# Altium schematic sheet CM5 Adapter.SchDoc
size C; SheetNumber: 1; SheetTotal: 1
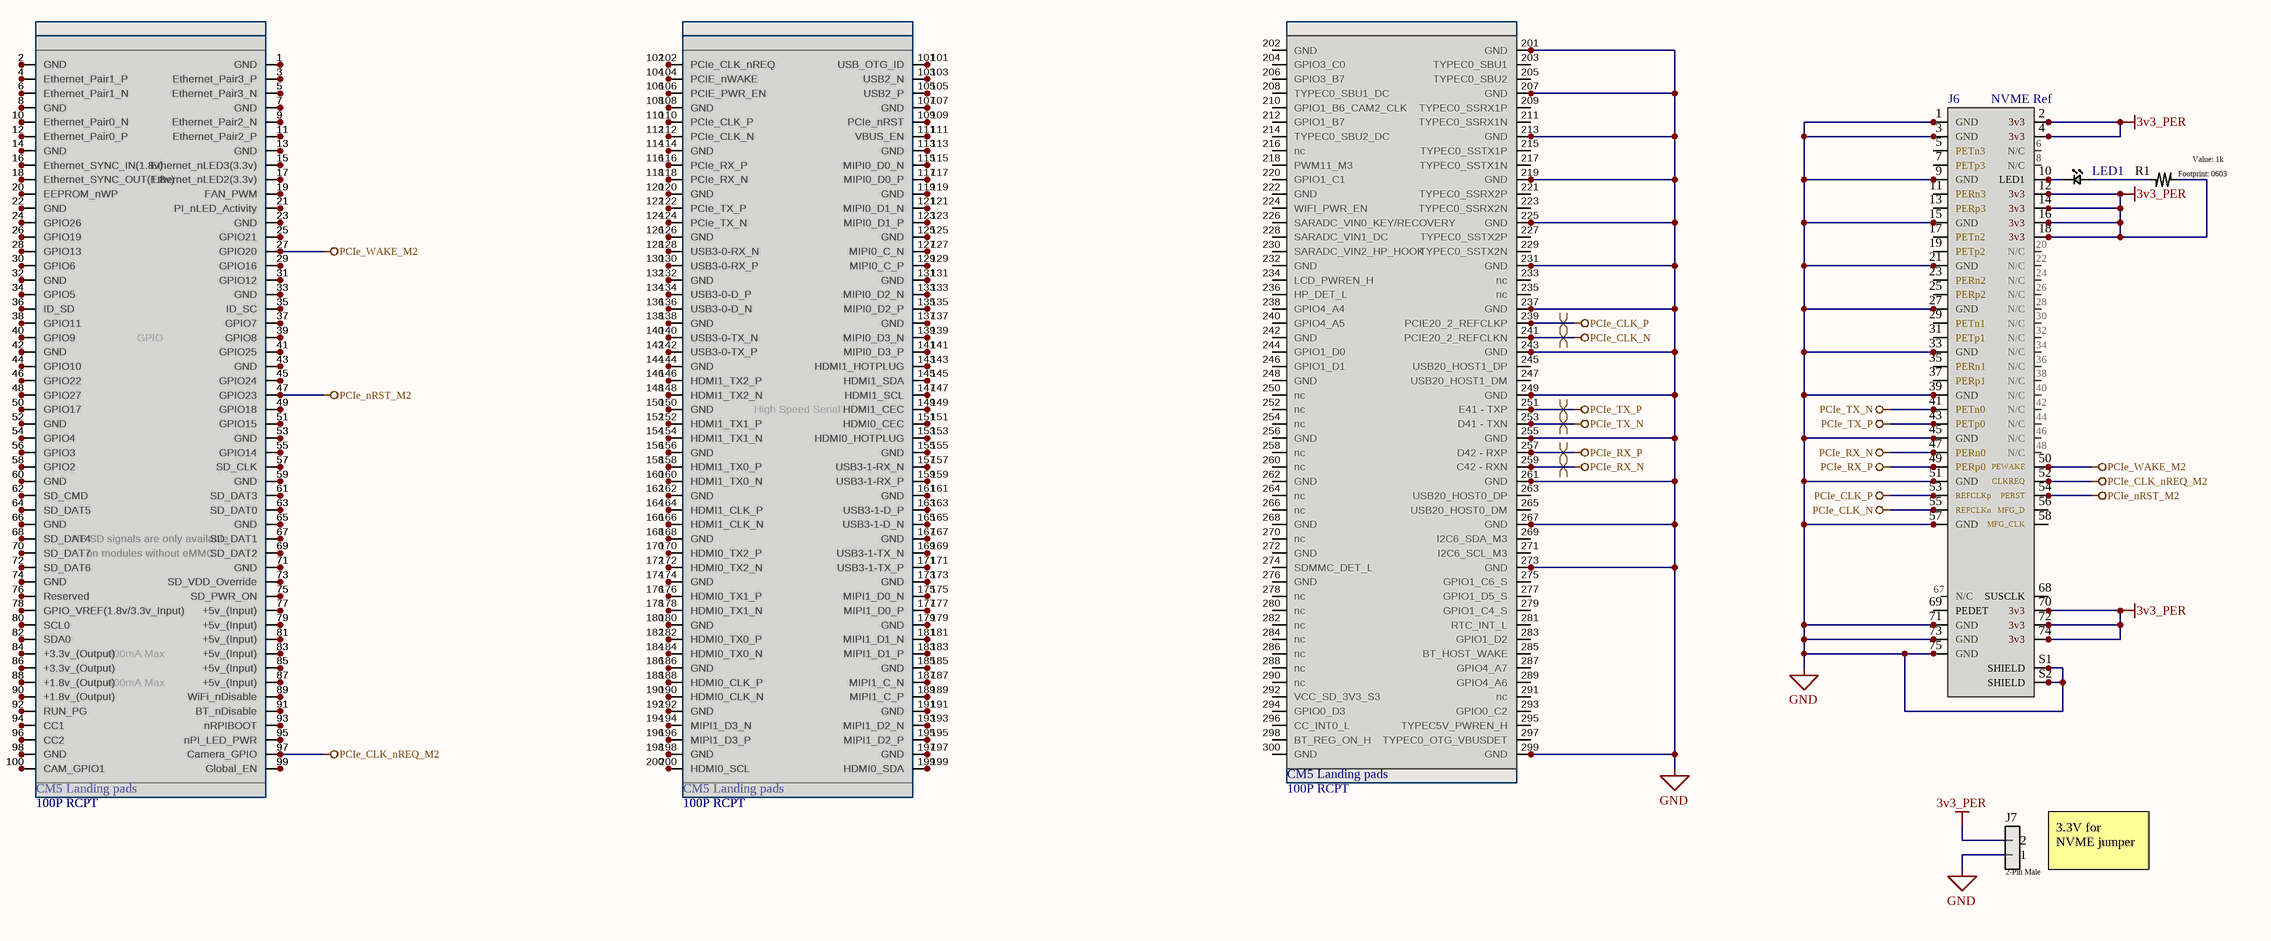
[diagram p0: CM5 Adapter.SchDoc]

## Parts
J1  100P RCPT  [DF40C-100DP-0.4V(51)]
J2  100P RCPT  [DF40C-100DP-0.4V(51)]
J3  100P RCPT  [DF40HC(3.0)-100DS-0.4V(51)]
J4  100P RCPT  [DF40HC(3.0)-100DS-0.4V(51)]
J5  100P RCPT  [DF40HC(3.0)-100DS-0.4V(51)]
J6  M.2 M KEY  [1-2199230-6]  (value not drawn)
J7  2-Pin Male  [0022057025]
LED1  LTST-C191KGKT  [0603 (1608 Metric) Concave]  (value not drawn)
M.1  NVME Ref  [NVME-Ref]
R1  value 1k  [0603]  (hidden comment: Generic Resistor)
rPI1  CM5 Landing pads  [rP-200P-CM-REP]  (parts A,B of 2)
rxPI1  CM5 Landing pads  [RX-300P-CM-FTPD]  (parts A,B,C of 3)

## Nets
3v3_PER: J6.2(3v3) J6.4(3v3) J6.12(3v3) J6.14(3v3) J6.16(3v3) J6.18(3v3) J6.70(3v3) J6.72(3v3) J6.74(3v3) J7.2 M.1.2(3v3) M.1.4(3v3) M.1.12(3v3) M.1.14(3v3) M.1.16(3v3) M.1.18(3v3) M.1.70(3v3) M.1.72(3v3) M.1.74(3v3) R1.2
GND: J3.2 J3.8 J3.14 J3.20 J3.26 J3.32 J3.38 J3.44 J3.50 J3.56 J3.62 J3.68 J3.74 J3.100 J6.1(GND) J6.3(GND) J6.9(GND) J6.15(GND) J6.21(GND) J6.27(GND) J6.33(GND) J6.39(GND) J6.45(GND) J6.51(GND) J6.57(GND) J6.71(GND) J6.73(GND) J6.75(GND) J6.S1(SHIELD) J6.S2(SHIELD) J7.1 M.1.1(GND) M.1.3(GND) M.1.9(GND) M.1.15(GND) M.1.21(GND) M.1.27(GND) M.1.33(GND) M.1.39(GND) M.1.45(GND) M.1.51(GND) M.1.57(GND) M.1.71(GND) M.1.73(GND) M.1.75(GND) M.1.S1(SHIELD) M.1.S2(SHIELD) M.1.SHD(SHIELD) rxPI1.201(GND) rxPI1.207(GND) rxPI1.213(GND) rxPI1.219(GND) rxPI1.225(GND) rxPI1.231(GND) rxPI1.237(GND) rxPI1.243(GND) rxPI1.249(GND) rxPI1.255(GND) rxPI1.261(GND) rxPI1.267(GND) rxPI1.273(GND) rxPI1.299(GND)
PCIe_CLK_N: J3.42 J6.55(REFCLKn) M.1.55(REFCLKn) rxPI1.241(PCIE20_2_REFCLKN)
PCIe_CLK_nREQ_M2: J1.98 J4.97 J6.52(CLKREQ) M.1.52(CLKREQ) rPI1.97(Camera_GPIO) rxPI1.97(Camera_GPIO)
PCIe_CLK_P: J3.40 J6.53(REFCLKp) M.1.53(REFCLKp) rxPI1.239(PCIE20_2_REFCLKP)
PCIe_nRST_M2: J1.48 J4.47 J6.54(PERST) M.1.54(PERST) rPI1.47(GPIO23) rxPI1.47(GPIO23)
PCIe_RX_N: J3.60 J6.47(PERn0) M.1.47(PERn0) rxPI1.259(C42_-_RXN)
PCIe_RX_P: J3.58 J6.49(PERp0) M.1.49(PERp0) rxPI1.257(D42_-_RXP)
PCIe_TX_N: J3.54 J6.41(PETn0) M.1.41(PETn0) rxPI1.253(D41_-_TXN)
PCIe_TX_P: J3.52 J6.43(PETp0) M.1.43(PETp0) rxPI1.251(E41_-_TXP)
PCIe_WAKE_M2: J1.28 J4.27 J6.50(PEWAKE) M.1.50(PEWAKE) rPI1.27(GPIO20) rxPI1.27(GPIO20)
NetJ1_1: J1.1 J4.2 rPI1.2(GND) rxPI1.2(GND)
NetJ1_2: J1.2 J4.1 rPI1.1(GND) rxPI1.1(GND)
NetJ1_3: J1.3 J4.4 rPI1.4(Ethernet_Pair1_P) rxPI1.4(Ethernet_Pair1_P)
NetJ1_4: J1.4 J4.3 rPI1.3(Ethernet_Pair3_P) rxPI1.3(Ethernet_Pair3_P)
NetJ1_5: J1.5 J4.6 rPI1.6(Ethernet_Pair1_N) rxPI1.6(Ethernet_Pair1_N)
NetJ1_6: J1.6 J4.5 rPI1.5(Ethernet_Pair3_N) rxPI1.5(Ethernet_Pair3_N)
NetJ1_7: J1.7 J4.8 rPI1.8(GND) rxPI1.8(GND)
NetJ1_8: J1.8 J4.7 rPI1.7(GND) rxPI1.7(GND)
NetJ1_9: J1.9 J4.10 rPI1.10(Ethernet_Pair0_N) rxPI1.10(Ethernet_Pair0_N)
NetJ1_10: J1.10 J4.9 rPI1.9(Ethernet_Pair2_N) rxPI1.9(Ethernet_Pair2_N)
NetJ1_11: J1.11 J4.12 rPI1.12(Ethernet_Pair0_P) rxPI1.12(Ethernet_Pair0_P)
NetJ1_12: J1.12 J4.11 rPI1.11(Ethernet_Pair2_P) rxPI1.11(Ethernet_Pair2_P)
NetJ1_13: J1.13 J4.14 rPI1.14(GND) rxPI1.14(GND)
NetJ1_14: J1.14 J4.13 rPI1.13(GND) rxPI1.13(GND)
NetJ1_15: J1.15 J4.16 rPI1.16(Ethernet_SYNC_IN(1.8v)) rxPI1.16(Ethernet_SYNC_IN(1.8v))
NetJ1_16: J1.16 J4.15 rPI1.15(Ethernet_nLED3(3.3v)) rxPI1.15(Ethernet_nLED3(3.3v))
NetJ1_17: J1.17 J4.18 rPI1.18(Ethernet_SYNC_OUT(1.8v)) rxPI1.18(Ethernet_SYNC_OUT(1.8v))
NetJ1_18: J1.18 J4.17 rPI1.17(Ethernet_nLED2(3.3v)) rxPI1.17(Ethernet_nLED2(3.3v))
NetJ1_19: J1.19 J4.20 rPI1.20(EEPROM_nWP) rxPI1.20(EEPROM_nWP)
NetJ1_20: J1.20 J4.19 rPI1.19(FAN_PWM) rxPI1.19(FAN_PWM)
NetJ1_21: J1.21 J4.22 rPI1.22(GND) rxPI1.22(GND)
NetJ1_22: J1.22 J4.21 rPI1.21(PI_nLED_Activity) rxPI1.21(PI_nLED_Activity)
NetJ1_23: J1.23 J4.24 rPI1.24(GPIO26) rxPI1.24(GPIO26)
NetJ1_24: J1.24 J4.23 rPI1.23(GND) rxPI1.23(GND)
NetJ1_25: J1.25 J4.26 rPI1.26(GPIO19) rxPI1.26(GPIO19)
NetJ1_26: J1.26 J4.25 rPI1.25(GPIO21) rxPI1.25(GPIO21)
NetJ1_27: J1.27 J4.28 rPI1.28(GPIO13) rxPI1.28(GPIO13)
NetJ1_29: J1.29 J4.30 rPI1.30(GPIO6) rxPI1.30(GPIO6)
NetJ1_30: J1.30 J4.29 rPI1.29(GPIO16) rxPI1.29(GPIO16)
NetJ1_31: J1.31 J4.32 rPI1.32(GND) rxPI1.32(GND)
NetJ1_32: J1.32 J4.31 rPI1.31(GPIO12) rxPI1.31(GPIO12)
NetJ1_33: J1.33 J4.34 rPI1.34(GPIO5) rxPI1.34(GPIO5)
NetJ1_34: J1.34 J4.33 rPI1.33(GND) rxPI1.33(GND)
NetJ1_35: J1.35 J4.36 rPI1.36(ID_SD) rxPI1.36(ID_SD)
NetJ1_36: J1.36 J4.35 rPI1.35(ID_SC) rxPI1.35(ID_SC)
NetJ1_37: J1.37 J4.38 rPI1.38(GPIO11) rxPI1.38(GPIO11)
NetJ1_38: J1.38 J4.37 rPI1.37(GPIO7) rxPI1.37(GPIO7)
NetJ1_39: J1.39 J4.40 rPI1.40(GPIO9) rxPI1.40(GPIO9)
NetJ1_40: J1.40 J4.39 rPI1.39(GPIO8) rxPI1.39(GPIO8)
NetJ1_41: J1.41 J4.42 rPI1.42(GND) rxPI1.42(GND)
NetJ1_42: J1.42 J4.41 rPI1.41(GPIO25) rxPI1.41(GPIO25)
NetJ1_43: J1.43 J4.44 rPI1.44(GPIO10) rxPI1.44(GPIO10)
NetJ1_44: J1.44 J4.43 rPI1.43(GND) rxPI1.43(GND)
NetJ1_45: J1.45 J4.46 rPI1.46(GPIO22) rxPI1.46(GPIO22)
NetJ1_46: J1.46 J4.45 rPI1.45(GPIO24) rxPI1.45(GPIO24)
NetJ1_47: J1.47 J4.48 rPI1.48(GPIO27) rxPI1.48(GPIO27)
NetJ1_49: J1.49 J4.50 rPI1.50(GPIO17) rxPI1.50(GPIO17)
NetJ1_50: J1.50 J4.49 rPI1.49(GPIO18) rxPI1.49(GPIO18)
NetJ1_51: J1.51 J4.52 rPI1.52(GND) rxPI1.52(GND)
NetJ1_52: J1.52 J4.51 rPI1.51(GPIO15) rxPI1.51(GPIO15)
NetJ1_53: J1.53 J4.54 rPI1.54(GPIO4) rxPI1.54(GPIO4)
NetJ1_54: J1.54 J4.53 rPI1.53(GND) rxPI1.53(GND)
NetJ1_55: J1.55 J4.56 rPI1.56(GPIO3) rxPI1.56(GPIO3)
NetJ1_56: J1.56 J4.55 rPI1.55(GPIO14) rxPI1.55(GPIO14)
NetJ1_57: J1.57 J4.58 rPI1.58(GPIO2) rxPI1.58(GPIO2)
NetJ1_58: J1.58 J4.57 rPI1.57(SD_CLK) rxPI1.57(SD_CLK)
NetJ1_59: J1.59 J4.60 rPI1.60(GND) rxPI1.60(GND)
NetJ1_60: J1.60 J4.59 rPI1.59(GND) rxPI1.59(GND)
NetJ1_61: J1.61 J4.62 rPI1.62(SD_CMD) rxPI1.62(SD_CMD)
NetJ1_62: J1.62 J4.61 rPI1.61(SD_DAT3) rxPI1.61(SD_DAT3)
NetJ1_63: J1.63 J4.64 rPI1.64(SD_DAT5) rxPI1.64(SD_DAT5)
NetJ1_64: J1.64 J4.63 rPI1.63(SD_DAT0) rxPI1.63(SD_DAT0)
NetJ1_65: J1.65 J4.66 rPI1.66(GND) rxPI1.66(GND)
NetJ1_66: J1.66 J4.65 rPI1.65(GND) rxPI1.65(GND)
NetJ1_67: J1.67 J4.68 rPI1.68(SD_DAT4) rxPI1.68(SD_DAT4)
NetJ1_68: J1.68 J4.67 rPI1.67(SD_DAT1) rxPI1.67(SD_DAT1)
NetJ1_69: J1.69 J4.70 rPI1.70(SD_DAT7) rxPI1.70(SD_DAT7)
NetJ1_70: J1.70 J4.69 rPI1.69(SD_DAT2) rxPI1.69(SD_DAT2)
NetJ1_71: J1.71 J4.72 rPI1.72(SD_DAT6) rxPI1.72(SD_DAT6)
NetJ1_72: J1.72 J4.71 rPI1.71(GND) rxPI1.71(GND)
NetJ1_73: J1.73 J4.74 rPI1.74(GND) rxPI1.74(GND)
NetJ1_74: J1.74 J4.73 rPI1.73(SD_VDD_Override) rxPI1.73(SD_VDD_Override)
NetJ1_75: J1.75 J4.76 rPI1.76(Reserved) rxPI1.76(Reserved)
NetJ1_76: J1.76 J4.75 rPI1.75(SD_PWR_ON) rxPI1.75(SD_PWR_ON)
NetJ1_77: J1.77 J4.78 rPI1.78(GPIO_VREF(1.8v/3.3v_Input)) rxPI1.78(GPIO_VREF(1.8v/3.3v_Input))
NetJ1_78: J1.78 J4.77 rPI1.77(+5v_(Input)) rxPI1.77(+5v_(Input))
NetJ1_79: J1.79 J4.80 rPI1.80(SCL0) rxPI1.80(SCL0)
NetJ1_80: J1.80 J4.79 rPI1.79(+5v_(Input)) rxPI1.79(+5v_(Input))
NetJ1_81: J1.81 J4.82 rPI1.82(SDA0) rxPI1.82(SDA0)
NetJ1_82: J1.82 J4.81 rPI1.81(+5v_(Input)) rxPI1.81(+5v_(Input))
NetJ1_83: J1.83 J4.84 rPI1.84(+3.3v_(Output)) rxPI1.84(+3.3v_(Output))
NetJ1_84: J1.84 J4.83 rPI1.83(+5v_(Input)) rxPI1.83(+5v_(Input))
NetJ1_85: J1.85 J4.86 rPI1.86(+3.3v_(Output)) rxPI1.86(+3.3v_(Output))
NetJ1_86: J1.86 J4.85 rPI1.85(+5v_(Input)) rxPI1.85(+5v_(Input))
NetJ1_87: J1.87 J4.88 rPI1.88(+1.8v_(Output)) rxPI1.88(+1.8v_(Output))
NetJ1_88: J1.88 J4.87 rPI1.87(+5v_(Input)) rxPI1.87(+5v_(Input))
NetJ1_89: J1.89 J4.90 rPI1.90(+1.8v_(Output)) rxPI1.90(+1.8v_(Output))
NetJ1_90: J1.90 J4.89 rPI1.89(WiFi_nDisable) rxPI1.89(WiFi_nDisable)
NetJ1_91: J1.91 J4.92 rPI1.92(RUN_PG) rxPI1.92(RUN_PG)
NetJ1_92: J1.92 J4.91 rPI1.91(BT_nDisable) rxPI1.91(BT_nDisable)
NetJ1_93: J1.93 J4.94 rPI1.94(CC1) rxPI1.94(CC1)
NetJ1_94: J1.94 J4.93 rPI1.93(nRPIBOOT) rxPI1.93(nRPIBOOT)
NetJ1_95: J1.95 J4.96 rPI1.96(CC2) rxPI1.96(CC2)
NetJ1_96: J1.96 J4.95 rPI1.95(nPI_LED_PWR) rxPI1.95(nPI_LED_PWR)
NetJ1_97: J1.97 J4.98 rPI1.98(GND) rxPI1.98(GND)
NetJ1_99: J1.99 J4.100 rPI1.100(CAM_GPIO1) rxPI1.100(CAM_GPIO1)
NetJ1_100: J1.100 J4.99 rPI1.99(Global_EN) rxPI1.99(Global_EN)
NetJ2_1: J2.1 J5.2 rPI1.102(PCIe_CLK_nREQ) rxPI1.102(PCIe_CLK_nREQ)
NetJ2_2: J2.2 J5.1 rPI1.101(USB_OTG_ID) rxPI1.101(USB_OTG_ID)
NetJ2_3: J2.3 J5.4 rPI1.104(PCIE_nWAKE) rxPI1.104(PCIE_nWAKE)
NetJ2_4: J2.4 J5.3 rPI1.103(USB2_N) rxPI1.103(USB2_N)
NetJ2_5: J2.5 J5.6 rPI1.106(PCIE_PWR_EN) rxPI1.106(PCIE_PWR_EN)
NetJ2_6: J2.6 J5.5 rPI1.105(USB2_P) rxPI1.105(USB2_P)
NetJ2_7: J2.7 J5.8 rPI1.108(GND) rxPI1.108(GND)
NetJ2_8: J2.8 J5.7 rPI1.107(GND) rxPI1.107(GND)
NetJ2_9: J2.9 J5.10 rPI1.110(PCIe_CLK_P) rxPI1.110(PCIe_CLK_P)
NetJ2_10: J2.10 J5.9 rPI1.109(PCIe_nRST) rxPI1.109(PCIe_nRST)
NetJ2_11: J2.11 J5.12 rPI1.112(PCIe_CLK_N) rxPI1.112(PCIe_CLK_N)
NetJ2_12: J2.12 J5.11 rPI1.111(VBUS_EN) rxPI1.111(VBUS_EN)
NetJ2_13: J2.13 J5.14 rPI1.114(GND) rxPI1.114(GND)
NetJ2_14: J2.14 J5.13 rPI1.113(GND) rxPI1.113(GND)
NetJ2_15: J2.15 J5.16 rPI1.116(PCIe_RX_P) rxPI1.116(PCIe_RX_P)
NetJ2_16: J2.16 J5.15 rPI1.115(MIPI0_D0_N) rxPI1.115(MIPI0_D0_N)
NetJ2_17: J2.17 J5.18 rPI1.118(PCIe_RX_N) rxPI1.118(PCIe_RX_N)
NetJ2_18: J2.18 J5.17 rPI1.117(MIPI0_D0_P) rxPI1.117(MIPI0_D0_P)
NetJ2_19: J2.19 J5.20 rPI1.120(GND) rxPI1.120(GND)
NetJ2_20: J2.20 J5.19 rPI1.119(GND) rxPI1.119(GND)
NetJ2_21: J2.21 J5.22 rPI1.122(PCIe_TX_P) rxPI1.122(PCIe_TX_P)
NetJ2_22: J2.22 J5.21 rPI1.121(MIPI0_D1_N) rxPI1.121(MIPI0_D1_N)
NetJ2_23: J2.23 J5.24 rPI1.124(PCIe_TX_N) rxPI1.124(PCIe_TX_N)
NetJ2_24: J2.24 J5.23 rPI1.123(MIPI0_D1_P) rxPI1.123(MIPI0_D1_P)
NetJ2_25: J2.25 J5.26 rPI1.126(GND) rxPI1.126(GND)
NetJ2_26: J2.26 J5.25 rPI1.125(GND) rxPI1.125(GND)
NetJ2_27: J2.27 J5.28 rPI1.128(USB3-0-RX_N) rxPI1.128(USB3-0-RX_N)
NetJ2_28: J2.28 J5.27 rPI1.127(MIPI0_C_N) rxPI1.127(MIPI0_C_N)
NetJ2_29: J2.29 J5.30 rPI1.130(USB3-0-RX_P) rxPI1.130(USB3-0-RX_P)
NetJ2_30: J2.30 J5.29 rPI1.129(MIPI0_C_P) rxPI1.129(MIPI0_C_P)
NetJ2_31: J2.31 J5.32 rPI1.132(GND) rxPI1.132(GND)
NetJ2_32: J2.32 J5.31 rPI1.131(GND) rxPI1.131(GND)
NetJ2_33: J2.33 J5.34 rPI1.134(USB3-0-D_P) rxPI1.134(USB3-0-D_P)
NetJ2_34: J2.34 J5.33 rPI1.133(MIPI0_D2_N) rxPI1.133(MIPI0_D2_N)
NetJ2_35: J2.35 J5.36 rPI1.136(USB3-0-D_N) rxPI1.136(USB3-0-D_N)
NetJ2_36: J2.36 J5.35 rPI1.135(MIPI0_D2_P) rxPI1.135(MIPI0_D2_P)
NetJ2_37: J2.37 J5.38 rPI1.138(GND) rxPI1.138(GND)
NetJ2_38: J2.38 J5.37 rPI1.137(GND) rxPI1.137(GND)
NetJ2_39: J2.39 J5.40 rPI1.140(USB3-0-TX_N) rxPI1.140(USB3-0-TX_N)
NetJ2_40: J2.40 J5.39 rPI1.139(MIPI0_D3_N) rxPI1.139(MIPI0_D3_N)
NetJ2_41: J2.41 J5.42 rPI1.142(USB3-0-TX_P) rxPI1.142(USB3-0-TX_P)
NetJ2_42: J2.42 J5.41 rPI1.141(MIPI0_D3_P) rxPI1.141(MIPI0_D3_P)
NetJ2_43: J2.43 J5.44 rPI1.144(GND) rxPI1.144(GND)
NetJ2_44: J2.44 J5.43 rPI1.143(HDMI1_HOTPLUG) rxPI1.143(HDMI1_HOTPLUG)
NetJ2_45: J2.45 J5.46 rPI1.146(HDMI1_TX2_P) rxPI1.146(HDMI1_TX2_P)
NetJ2_46: J2.46 J5.45 rPI1.145(HDMI1_SDA) rxPI1.145(HDMI1_SDA)
NetJ2_47: J2.47 J5.48 rPI1.148(HDMI1_TX2_N) rxPI1.148(HDMI1_TX2_N)
NetJ2_48: J2.48 J5.47 rPI1.147(HDMI1_SCL) rxPI1.147(HDMI1_SCL)
NetJ2_49: J2.49 J5.50 rPI1.150(GND) rxPI1.150(GND)
NetJ2_50: J2.50 J5.49 rPI1.149(HDMI1_CEC) rxPI1.149(HDMI1_CEC)
NetJ2_51: J2.51 J5.52 rPI1.152(HDMI1_TX1_P) rxPI1.152(HDMI1_TX1_P)
NetJ2_52: J2.52 J5.51 rPI1.151(HDMI0_CEC) rxPI1.151(HDMI0_CEC)
NetJ2_53: J2.53 J5.54 rPI1.154(HDMI1_TX1_N) rxPI1.154(HDMI1_TX1_N)
NetJ2_54: J2.54 J5.53 rPI1.153(HDMI0_HOTPLUG) rxPI1.153(HDMI0_HOTPLUG)
NetJ2_55: J2.55 J5.56 rPI1.156(GND) rxPI1.156(GND)
NetJ2_56: J2.56 J5.55 rPI1.155(GND) rxPI1.155(GND)
NetJ2_57: J2.57 J5.58 rPI1.158(HDMI1_TX0_P) rxPI1.158(HDMI1_TX0_P)
NetJ2_58: J2.58 J5.57 rPI1.157(USB3-1-RX_N) rxPI1.157(USB3-1-RX_N)
NetJ2_59: J2.59 J5.60 rPI1.160(HDMI1_TX0_N) rxPI1.160(HDMI1_TX0_N)
NetJ2_60: J2.60 J5.59 rPI1.159(USB3-1-RX_P) rxPI1.159(USB3-1-RX_P)
NetJ2_61: J2.61 J5.62 rPI1.162(GND) rxPI1.162(GND)
NetJ2_62: J2.62 J5.61 rPI1.161(GND) rxPI1.161(GND)
NetJ2_63: J2.63 J5.64 rPI1.164(HDMI1_CLK_P) rxPI1.164(HDMI1_CLK_P)
NetJ2_64: J2.64 J5.63 rPI1.163(USB3-1-D_P) rxPI1.163(USB3-1-D_P)
NetJ2_65: J2.65 J5.66 rPI1.166(HDMI1_CLK_N) rxPI1.166(HDMI1_CLK_N)
NetJ2_66: J2.66 J5.65 rPI1.165(USB3-1-D_N) rxPI1.165(USB3-1-D_N)
NetJ2_67: J2.67 J5.68 rPI1.168(GND) rxPI1.168(GND)
NetJ2_68: J2.68 J5.67 rPI1.167(GND) rxPI1.167(GND)
NetJ2_69: J2.69 J5.70 rPI1.170(HDMI0_TX2_P) rxPI1.170(HDMI0_TX2_P)
NetJ2_70: J2.70 J5.69 rPI1.169(USB3-1-TX_N) rxPI1.169(USB3-1-TX_N)
NetJ2_71: J2.71 J5.72 rPI1.172(HDMI0_TX2_N) rxPI1.172(HDMI0_TX2_N)
NetJ2_72: J2.72 J5.71 rPI1.171(USB3-1-TX_P) rxPI1.171(USB3-1-TX_P)
NetJ2_73: J2.73 J5.74 rPI1.174(GND) rxPI1.174(GND)
NetJ2_74: J2.74 J5.73 rPI1.173(GND) rxPI1.173(GND)
NetJ2_75: J2.75 J5.76 rPI1.176(HDMI0_TX1_P) rxPI1.176(HDMI0_TX1_P)
NetJ2_76: J2.76 J5.75 rPI1.175(MIPI1_D0_N) rxPI1.175(MIPI1_D0_N)
NetJ2_77: J2.77 J5.78 rPI1.178(HDMI0_TX1_N) rxPI1.178(HDMI0_TX1_N)
NetJ2_78: J2.78 J5.77 rPI1.177(MIPI1_D0_P) rxPI1.177(MIPI1_D0_P)
NetJ2_79: J2.79 J5.80 rPI1.180(GND) rxPI1.180(GND)
NetJ2_80: J2.80 J5.79 rPI1.179(GND) rxPI1.179(GND)
NetJ2_81: J2.81 J5.82 rPI1.182(HDMI0_TX0_P) rxPI1.182(HDMI0_TX0_P)
NetJ2_82: J2.82 J5.81 rPI1.181(MIPI1_D1_N) rxPI1.181(MIPI1_D1_N)
NetJ2_83: J2.83 J5.84 rPI1.184(HDMI0_TX0_N) rxPI1.184(HDMI0_TX0_N)
NetJ2_84: J2.84 J5.83 rPI1.183(MIPI1_D1_P) rxPI1.183(MIPI1_D1_P)
NetJ2_85: J2.85 J5.86 rPI1.186(GND) rxPI1.186(GND)
NetJ2_86: J2.86 J5.85 rPI1.185(GND) rxPI1.185(GND)
NetJ2_87: J2.87 J5.88 rPI1.188(HDMI0_CLK_P) rxPI1.188(HDMI0_CLK_P)
NetJ2_88: J2.88 J5.87 rPI1.187(MIPI1_C_N) rxPI1.187(MIPI1_C_N)
NetJ2_89: J2.89 J5.90 rPI1.190(HDMI0_CLK_N) rxPI1.190(HDMI0_CLK_N)
NetJ2_90: J2.90 J5.89 rPI1.189(MIPI1_C_P) rxPI1.189(MIPI1_C_P)
NetJ2_91: J2.91 J5.92 rPI1.192(GND) rxPI1.192(GND)
NetJ2_92: J2.92 J5.91 rPI1.191(GND) rxPI1.191(GND)
NetJ2_93: J2.93 J5.94 rPI1.194(MIPI1_D3_N) rxPI1.194(MIPI1_D3_N)
NetJ2_94: J2.94 J5.93 rPI1.193(MIPI1_D2_N) rxPI1.193(MIPI1_D2_N)
NetJ2_95: J2.95 J5.96 rPI1.196(MIPI1_D3_P) rxPI1.196(MIPI1_D3_P)
NetJ2_96: J2.96 J5.95 rPI1.195(MIPI1_D2_P) rxPI1.195(MIPI1_D2_P)
NetJ2_97: J2.97 J5.98 rPI1.198(GND) rxPI1.198(GND)
NetJ2_98: J2.98 J5.97 rPI1.197(GND) rxPI1.197(GND)
NetJ2_99: J2.99 J5.100 rPI1.200(HDMI0_SCL) rxPI1.200(HDMI0_SCL)
NetJ2_100: J2.100 J5.99 rPI1.199(HDMI0_SDA) rxPI1.199(HDMI0_SDA)
NetJ3_1: J3.1 rxPI1.202(GND)
NetJ3_3: J3.3 rxPI1.204(GPIO3_C0)
NetJ3_4: J3.4 rxPI1.203(TYPEC0_SBU1)
NetJ3_5: J3.5 rxPI1.206(GPIO3_B7)
NetJ3_6: J3.6 rxPI1.205(TYPEC0_SBU2)
NetJ3_7: J3.7 rxPI1.208(TYPEC0_SBU1_DC)
NetJ3_9: J3.9 rxPI1.210(GPIO1_B6_CAM2_CLK)
NetJ3_10: J3.10 rxPI1.209(TYPEC0_SSRX1P)
NetJ3_11: J3.11 rxPI1.212(GPIO1_B7)
NetJ3_12: J3.12 rxPI1.211(TYPEC0_SSRX1N)
NetJ3_13: J3.13 rxPI1.214(TYPEC0_SBU2_DC)
NetJ3_15: J3.15 rxPI1.216(nc)
NetJ3_16: J3.16 rxPI1.215(TYPEC0_SSTX1P)
NetJ3_17: J3.17 rxPI1.218(PWM11_M3)
NetJ3_18: J3.18 rxPI1.217(TYPEC0_SSTX1N)
NetJ3_19: J3.19 rxPI1.220(GPIO1_C1)
NetJ3_21: J3.21 rxPI1.222(GND)
NetJ3_22: J3.22 rxPI1.221(TYPEC0_SSRX2P)
NetJ3_23: J3.23 rxPI1.224(WIFI_PWR_EN)
NetJ3_24: J3.24 rxPI1.223(TYPEC0_SSRX2N)
NetJ3_25: J3.25 rxPI1.226(SARADC_VIN0_KEY/RECOVERY)
NetJ3_27: J3.27 rxPI1.228(SARADC_VIN1_DC)
NetJ3_28: J3.28 rxPI1.227(TYPEC0_SSTX2P)
NetJ3_29: J3.29 rxPI1.230(SARADC_VIN2_HP_HOOK)
NetJ3_30: J3.30 rxPI1.229(TYPEC0_SSTX2N)
NetJ3_31: J3.31 rxPI1.232(GND)
NetJ3_33: J3.33 rxPI1.234(LCD_PWREN_H)
NetJ3_34: J3.34 rxPI1.233(nc)
NetJ3_35: J3.35 rxPI1.236(HP_DET_L)
NetJ3_36: J3.36 rxPI1.235(nc)
NetJ3_37: J3.37 rxPI1.238(GPIO4_A4)
NetJ3_39: J3.39 rxPI1.240(GPIO4_A5)
NetJ3_41: J3.41 rxPI1.242(GND)
NetJ3_43: J3.43 rxPI1.244(GPIO1_D0)
NetJ3_45: J3.45 rxPI1.246(GPIO1_D1)
NetJ3_46: J3.46 rxPI1.245(USB20_HOST1_DP)
NetJ3_47: J3.47 rxPI1.248(GND)
NetJ3_48: J3.48 rxPI1.247(USB20_HOST1_DM)
NetJ3_49: J3.49 rxPI1.250(nc)
NetJ3_51: J3.51 rxPI1.252(nc)
NetJ3_53: J3.53 rxPI1.254(nc)
NetJ3_55: J3.55 rxPI1.256(GND)
NetJ3_57: J3.57 rxPI1.258(nc)
NetJ3_59: J3.59 rxPI1.260(nc)
NetJ3_61: J3.61 rxPI1.262(GND)
NetJ3_63: J3.63 rxPI1.264(nc)
NetJ3_64: J3.64 rxPI1.263(USB20_HOST0_DP)
NetJ3_65: J3.65 rxPI1.266(nc)
NetJ3_66: J3.66 rxPI1.265(USB20_HOST0_DM)
NetJ3_67: J3.67 rxPI1.268(GND)
NetJ3_69: J3.69 rxPI1.270(nc)
NetJ3_70: J3.70 rxPI1.269(I2C6_SDA_M3)
NetJ3_71: J3.71 rxPI1.272(GND)
NetJ3_72: J3.72 rxPI1.271(I2C6_SCL_M3)
NetJ3_73: J3.73 rxPI1.274(SDMMC_DET_L)
NetJ3_75: J3.75 rxPI1.276(GND)
NetJ3_76: J3.76 rxPI1.275(GPIO1_C6_S)
NetJ3_77: J3.77 rxPI1.278(nc)
NetJ3_78: J3.78 rxPI1.277(GPIO1_D5_S)
NetJ3_79: J3.79 rxPI1.280(nc)
NetJ3_80: J3.80 rxPI1.279(GPIO1_C4_S)
NetJ3_81: J3.81 rxPI1.282(nc)
NetJ3_82: J3.82 rxPI1.281(RTC_INT_L)
NetJ3_83: J3.83 rxPI1.284(nc)
NetJ3_84: J3.84 rxPI1.283(GPIO1_D2)
NetJ3_85: J3.85 rxPI1.286(nc)
NetJ3_86: J3.86 rxPI1.285(BT_HOST_WAKE)
NetJ3_87: J3.87 rxPI1.288(nc)
NetJ3_88: J3.88 rxPI1.287(GPIO4_A7)
NetJ3_89: J3.89 rxPI1.290(nc)
NetJ3_90: J3.90 rxPI1.289(GPIO4_A6)
NetJ3_91: J3.91 rxPI1.292(VCC_SD_3V3_S3)
NetJ3_92: J3.92 rxPI1.291(nc)
NetJ3_93: J3.93 rxPI1.294(GPIO0_D3)
NetJ3_94: J3.94 rxPI1.293(GPIO0_C2)
NetJ3_95: J3.95 rxPI1.296(CC_INT0_L)
NetJ3_96: J3.96 rxPI1.295(TYPEC5V_PWREN_H)
NetJ3_97: J3.97 rxPI1.298(BT_REG_ON_H)
NetJ3_98: J3.98 rxPI1.297(TYPEC0_OTG_VBUSDET)
NetJ3_99: J3.99 rxPI1.300(GND)
NetJ6_5: J6.5(PETn3) M.1.5(PETn3)
NetJ6_6: J6.6(N/C) M.1.6(N/C)
NetJ6_7: J6.7(PETp3) M.1.7(PETp3)
NetJ6_8: J6.8(N/C) M.1.8(N/C)
NetJ6_10: J6.10(LED1) LED1.1(Cathode) M.1.10(LED1)
NetJ6_11: J6.11(PERn3) M.1.11(PERn3)
NetJ6_13: J6.13(PERp3) M.1.13(PERp3)
NetJ6_17: J6.17(PETn2) M.1.17(PETn2)
NetJ6_19: J6.19(PETp2) M.1.19(PETp2)
NetJ6_20: J6.20(N/C) M.1.20(N/C)
NetJ6_22: J6.22(N/C) M.1.22(N/C)
NetJ6_23: J6.23(PERn2) M.1.23(PERn2)
NetJ6_24: J6.24(N/C) M.1.24(N/C)
NetJ6_25: J6.25(PERp2) M.1.25(PERp2)
NetJ6_26: J6.26(N/C) M.1.26(N/C)
NetJ6_28: J6.28(N/C) M.1.28(N/C)
NetJ6_29: J6.29(PETn1) M.1.29(PETn1)
NetJ6_30: J6.30(N/C) M.1.30(N/C)
NetJ6_31: J6.31(PETp1) M.1.31(PETp1)
NetJ6_32: J6.32(N/C) M.1.32(N/C)
NetJ6_34: J6.34(N/C) M.1.34(N/C)
NetJ6_35: J6.35(PERn1) M.1.35(PERn1)
NetJ6_36: J6.36(N/C) M.1.36(N/C)
NetJ6_37: J6.37(PERp1) M.1.37(PERp1)
NetJ6_38: J6.38(N/C) M.1.38(N/C)
NetJ6_40: J6.40(N/C) M.1.40(N/C)
NetJ6_42: J6.42(N/C) M.1.42(N/C)
NetJ6_44: J6.44(N/C) M.1.44(N/C)
NetJ6_46: J6.46(N/C) M.1.46(N/C)
NetJ6_48: J6.48(N/C) M.1.48(N/C)
NetJ6_56: J6.56(MFG_D) M.1.56(MFG_D)
NetJ6_58: J6.58(MFG_CLK) M.1.58(MFG_CLK)
NetJ6_67: J6.67(N/C) M.1.67(N/C)
NetJ6_68: J6.68(SUSCLK) M.1.68(SUSCLK)
NetJ6_69: J6.69(PEDET) M.1.69(PEDET)
NetLED1_2: LED1.2(Anode) R1.1

## Layout directives
differential pair: PCIe_CLK_N, PCIe_CLK_P, PCIe_RX_N, PCIe_RX_P, PCIe_TX_N, PCIe_TX_P

## Notes on the sheet
- (near J7) 3.3V for NVME jumper
- REV
- REVISIONS
- DATE
- DESCRIPTION
- BY
- UNLESS OTHERWISE SPECIFIED, DRAWING DEFINITIONS AND TOLERANCES SHALL BE FOUND UNDER SUPPLIER STANDARDS SS-001. THIS PART AND ALL COMPONENTS OF IT MUST BE RoHS & REACH COMPLIANT. A CERTIFICATE OF COMPLIANCE MUST BE PROVIDED UPON REQUEST.
- ALL INFORMATION ON THIS DOCUMENT IS THE SOLE PROPERTY OF GAMBER-JOHNSON AND SHALL NOT BE COPIED, REPRODUCED, USED OR DISCLOSED IN WHOLE OR IN PART WITHOUT THE WRITTEN CONSENT OF GAMBER-JOHNSON
- TOLERANCES
  .00 ± .060
  .000 ± .020
  .0000 ± .005
  ANGELS ± 1°
- DRAWN BY:
- PROJECT NUMBER:
- SHEET TITLE:
- SHEET
- OF
- DATE:
- LOCATION:
- ASSEMBLY NUMBER
- SIZE
- GAMBER-JOHNSON LLC
  5001 JOERNS DR.
  STEVENS POINT, WI 54481
  +1 (715) 344-5209
- B
- (in symbol RP-CM5-Rep, part A) GPIO; NB SD signals are only available; on modules without eMMC; 600mA Max
- (in symbol RP-CM5-Rep, part B) High Speed Serial
- (in symbol RX-CM5, part A) GPIO; NB SD signals are only available; on modules without eMMC; 600mA Max
- (in symbol RX-CM5, part B) High Speed Serial

## Library data of the parts
J1 J2 = DF40-XX-100DS RCPT: 100 Position Connector Receptacle, Center Strip Contacts Surface Mount Gold; MF: Hirose; MP: DF40C-100DS-0.4V(51); SnapEDA_Link: https://www.snapeda.com/parts/DF40C-100DS-0.4V(51)/Hirose/view-part/?ref=snap; Package: None; Value: *; Check_prices: https://www.snapeda.com/parts/DF40C-100DS-0.4V(51)/Hirose/view-part/?ref=eda; LCSC PN: C19089239; Supplier 1: Avnet; Supplier Part Number 1: DF40C-100DS-0.4V(5; Supplier 2: Digikey; Supplier Part Number 2: 26-DF40HC(3.0)-100DS-0.4V(51)CT-ND
J3-J5 = DF40-100DS RCPT_1: 100 Position Connector Receptacle, Center Strip Contacts Surface Mount Gold; MF: Hirose; MP: DF40C-100DS-0.4V(51); SnapEDA_Link: https://www.snapeda.com/parts/DF40C-100DS-0.4V(51)/Hirose/view-part/?ref=snap; Package: None; Value: *; Check_prices: https://www.snapeda.com/parts/DF40C-100DS-0.4V(51)/Hirose/view-part/?ref=eda; LCSC PN: C597931; Supplier 1: Avnet; Supplier Part Number 1: DF40C-100DS-0.4V(5; Supplier 2: Digikey; Supplier Part Number 2: 26-DF40HC(3.0)-100DS-0.4V(51)CT-ND
J6 = 1-2199230-6_1: M.2 0.5PITCH 4.2H KEY M 30U AU; MF: TE Connectivity; Package: None; Digi-Key_Part_Number: A118046TR-ND; Purchase-URL: https://pricing.snapeda.com/search/part/1-2199230-6/?ref=eda; Check_prices: https://www.snapeda.com/parts/1-2199230-6/TE+Connectivity+AMP+Connectors/view-part/?ref=eda; MP: 1-2199230-6; SnapEDA_Link: https://www.snapeda.com/parts/1-2199230-6/TE+Connectivity+AMP+Connectors/view-part/?ref=snap; Value: *
J7 = 0022057025: Conn Shrouded Header (4 Sides) HDR 2 POS 2.5mm Solder RA Thru-Hole SPOX™ Bag; Manufacturer 1: Molex; Number of Poles: 2; Voltage Rating: 250V; Contact Resistance: 20mR; Max Voltage Rating (DC): 250.25kV; Max Voltage Rating (AC): 125V; Current Rating: 3A; Insulation Resistance: 1GR; Connector Type: Male Pin; Shrouded: Yes (With); Test Voltage: 1kV; Glow Wire Compliant: Non-compliant; Supplier 1: RSComponents; Manufacturer Part Number 1: 22-05-7025; RoHS: Yes; Category: Headers and Wire Housings; Stock 1: 1440; Pricing 1: 10=0.40100, 250=0.36000, 1000=0.24900, 5000=0.22200, 10000=0.20700 (USD); Mount: Through Hole,Surface Mount; Contact Plating: Tin,Copper; Contact Material: Brass,Bronze; Housing Color: Natural; Housing Material: Nylon; Color: Natural; Material: Nylon,Polyamide; Insulation Material: Nylon; Min Operating Temperature: -40°C; Max Operating Temperature: 105°C; Packaging: Bulk; Gender: Male; Number of Rows: 1; Termination: Solder; Number of Contacts: 2; Orientation: Right Angle; Package Quantity: 1; Voltage Rating (AC): 250V; Number of Positions: 2; Working Voltage: 250V; Voltage Rating (DC): 250V; Number of Circuits: 2; Contact Gender: Male; Series: SPOX™ 5268; Contact Type: Male Pin; Length: 7.65mm; Height: 5.7mm; Pitch: 2.5mm; Depth: 5.1mm; Lead Pitch: 2.5mm; Contact Mating Length: 0.138inch; Radiation Hardening: No; RoHS Compliant: Yes; REACH SVHC: Unknown; Lead Free: Lead Free; Flammability Rating: UL94 V-0; ComponentLink1URL: https://datasheet.ciiva.com/711/022057025-sd-711958.pdf?src-supplier=Digi-Key; ComponentLink1Description: https://datasheet.ciiva.com/711/022057025-sd-711958.pdf?src-supplier=Digi-Key; ComponentLink2URL: https://datasheet.ciiva.com/25265/1766960-25265813.pdf?src-supplier=Newark; ComponentLink2Description: https://datasheet.ciiva.com/25265/1766960-25265813.pdf?src-supplier=Newark; ComponentLink3URL: https://datasheet.ciiva.com/5155/0022057025-pcb-headers-158480-5155683.pdf?src-supplier=Mouser; ComponentLink3Description: https://datasheet.ciiva.com/5155/0022057025-pcb-headers-158480-5155683.pdf?src-supplier=Mouser; ComponentLink4URL: https://datasheet.ciiva.com/19461/2017869-19461071.pdf?src-supplier=Jameco; ComponentLink4Description: https://datasheet.ciiva.com/19461/2017869-19461071.pdf?src-supplier=Jameco; ComponentLink5URL: https://datasheet.ciiva.com/11747/0900766b80da772b-11747276.pdf?src-supplier=RSComponents; ComponentLink5Description: https://datasheet.ciiva.com/11747/0900766b80da772b-11747276.pdf?src-supplier=RSComponents; ComponentLink6URL: https://datasheet.ciiva.com/7920/1877911-7920684.pdf?src-supplier=Element14; ComponentLink6Description: https://datasheet.ciiva.com/7920/1877911-7920684.pdf?src-supplier=Element14; ComponentLink7URL: https://datasheet.ciiva.com/9468/0022057025-pcb-headers-9468379.pdf?src-supplier=Avnet; ComponentLink7Description: https://datasheet.ciiva.com/9468/0022057025-pcb-headers-9468379.pdf?src-supplier=Avnet; Supplier Part Number 1: 6878086; LCSC PN: C918490
LED1 = CMP-013-000000-1: LED Uni-Color Green 574nm 2-Pin Chip LED T/R; Manufacturer 1: Vishay Lite-On; Number of Elements: 1; Viewing Angle: 130°; Lens Transparency: Clear; Power Dissipation: 75mW; Test Current: 20mA; Lens Style: Rectangular,Colorless; Reverse Voltage: 5V; Lens Color: Colorless; Forward Current: 30mA; Dominant Wavelength: 571nm; Forward Voltage: 2V; Luminous Intensity: 35mcd; Case Code (Imperial): 0603; Width: 0.8mm; Depth: 0.8mm; Case Code (Metric): 1608; Packaging: Tape and Reel; Number of LEDs: 1; Lead Free: Lead Free; Package Quantity: 1; Illumination Color: Green; Design Item ID: LTST-C191KGKT; Color: Green; Mount: Surface Mount; Source: Diodes.SchLib; Radiation Hardening: No; Wavelength: 574nm; RoHS: Yes; Max Power Dissipation: 75mW; RoHS Compliant: Yes; Power Rating: 75mW; Case/Package: 0603; Length: 1.6mm; Component Type: Standard; Number of Pins: 2; Height: 0.55mm; Stock 1: 4150; Pin Count: 2; ComponentLink1Description: https://datasheet.ciiva.com/2109/ltst-c191kgkt-2109973.pdf?src-supplier=Digi-Key; Manufacturer Part Number 1: LTST-C191KGKT; Category: LEDs; Min Operating Temperature: -55°C; ComponentLink1URL: https://datasheet.ciiva.com/2109/ltst-c191kgkt-2109973.pdf?src-supplier=Digi-Key; Max Operating Temperature: 85°C; Pricing 1: 50=0.14800, 250=0.06800, 500=0.06400, 1250=0.05400, 2500=0.05100 (USD)
M.1 = NVME Ref: Overlay pads w/ 1-2199230-6 / Use standoff for mounting screws
R1 = Generic Resistor: Tolerance: 1%; Power: 1/10W
rPI1 = RP-CM5-Rep: Compute Module 5 adapter Footprint / Overlap Hirose 100P connector over pads to place actual components
rxPI1 = RX-CM5: Radxa Compute Module 5 Footprint / Overlap Hirose 100P connector over pads to place actual components